# Altium schematic sheet SPI_Digital_Outputs.SchDoc
size A4; SheetNumber: 5; SheetTotal: 6
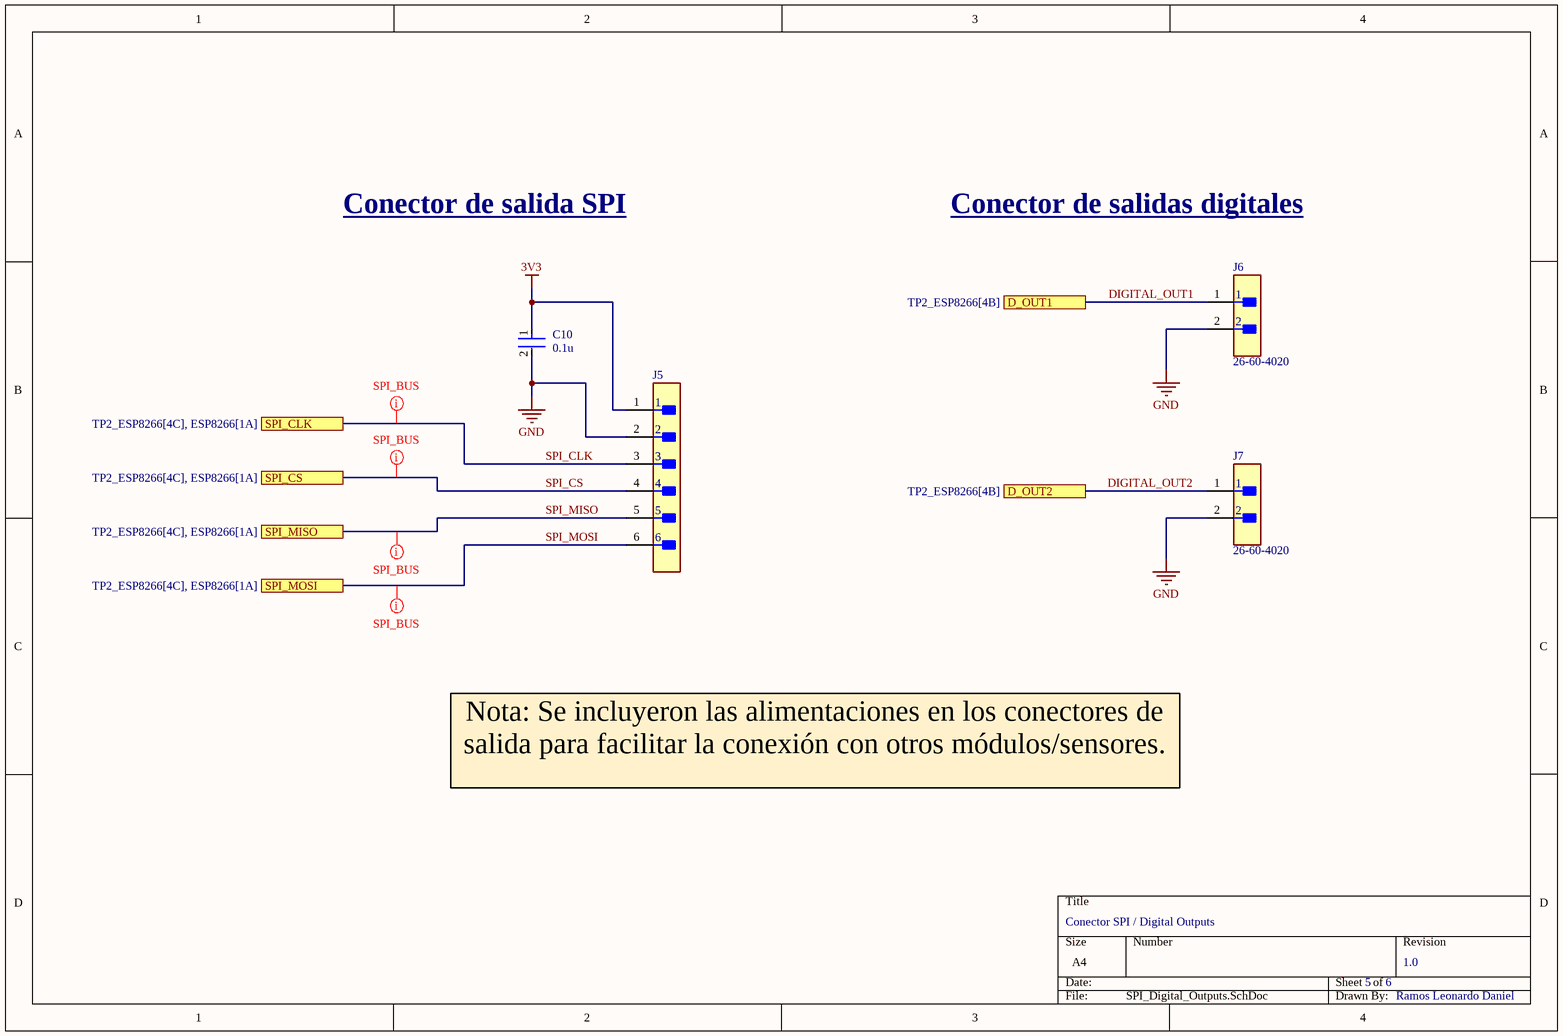
[diagram p0: SPI_Digital_Outputs.SchDoc]

## Parts
C10  value 0.1u  [FP-CC0805-0_85-MFG]  (hidden comment: CC0805KRX7R8BB104)
J5  22-27-2061  [FP-22-27-2061-MFG]  (value not drawn)
J6  26-60-4020  [FP-26-60-4020-MFG]
J7  26-60-4020  [FP-26-60-4020-MFG]

## Ports
D_OUT1 (see TP2_ESP8266[4B]), D_OUT2 (see TP2_ESP8266[4B]), SPI_CLK (see TP2_ESP8266[4C], ESP8266[1A]), SPI_CS (see TP2_ESP8266[4C], ESP8266[1A]), SPI_MISO (see TP2_ESP8266[4C], ESP8266[1A]), SPI_MOSI (see TP2_ESP8266[4C], ESP8266[1A])

## Nets
3V3: C10.1 J5.1
GND: C10.2 J5.2 J6.2 J7.2
DIGITAL_OUT1: J6.1 ; port D_OUT1
DIGITAL_OUT2: J7.1 ; port D_OUT2
SPI_CLK: J5.3 ; port SPI_CLK
SPI_CS: J5.4 ; port SPI_CS
SPI_MISO: J5.5 ; port SPI_MISO
SPI_MOSI: J5.6 ; port SPI_MOSI

## Layout directives
net class SPI_BUS: SPI_CLK, SPI_CS, SPI_MISO, SPI_MOSI

## Notes on the sheet
- Conector de salida SPI
- Conector de salidas digitales
- Nota: Se incluyeron las alimentaciones en los conectores de salida para facilitar la conexión con otros módulos/sensores.
- Conector SPI / Digital Outputs
- 5
- 6
- 1.0
- Ramos Leonardo Daniel

## Library data of the parts
C10 = CMP-1036-04410-2: CAP CER 0.1UF 25V X7R 0805; Manufacturer: Yageo; Tolerance: 0.1; Material: Ceramic; Capacitance: 100 nF; ComponentLink2URL: http://www.yageo.com/documents/recent/UPY-GPHC_Y5V_6.3V-to-50V_8.pdf; Category: Cap; Mouser Description: Multilayer Ceramic Capacitors MLCC - SMD/SMT 100nF 25V X7R 10%; Manufacturer Part Number: CC0805KRX7R8BB104; Device Class L1: Passive Components; Footprint Url: http://www.yageo.com/exep/pages/download/literatures/UPY-C_GEN_24.pdf; Height: 0.95mm; Digikey Description: CAP CER 0.1UF 25V X7R 0805; Lead Free: Yes; Temperature Range High: +85°C; Temperature: -30°C to +85°C; Ipc Land Pattern Name: CAPC200125X85; Automotive: No; Octopart: https://octopart.com/cc0805krx7r8bb104-yageo-39467766; Device Class L2: Capacitors; Temperature Characteristic: X7R; Voltage Rating: 25 V; ComponentLink2Description: Datasheet; Temperature Range Low: -30°C; Device Class L3: Ceramic Capacitors; RoHS: TRUE; Package: CC0805-0.85
J5 = CMP-04776-000309-1: CONN HEADER VERT 6POS 2.54MM; Number of Contacts: 6; Current Rating: 4A; Voltage Rating (AC): 250V; Contact Resistance: 10mR; Hole Diameter: 1.02mm; Connector Type: Male Pin; Gender: Male; Mount: Through Hole; REACH SVHC: No SVHC; Number of Rows: 1; Contact Plating: Tin; Series: KK; Depth: 5.8mm; Flammability Rating: UL94 V-0; Contact Type: Male Pin; Lead Pitch: 2.54mm; Min Operating Temperature: 0°C; Pitch: 2.54mm; Radiation Hardening: No; Color: Natural; Length: 15.24mm; Termination: Solder; Orientation: Straight; Contact Material: Brass; Max Voltage Rating (AC): 250V; Housing Material: Nylon; Max Operating Temperature: 75°C; Working Voltage: 250V; Max Current Rating: 4A; Fastening Type: Friction; Voltage Rating: 250V; Housing Color: White; Packaging: Bulk; Material: Nylon; Contact Mating Length: 0.295inch; Package Quantity: 10000; Number of Positions: 6
J6 J7 = CMP-04776-000303-1: CONN HEADER VERT 2POS 3.96MM; Number of Contacts: 2; Contact Resistance: 6mR; Current Rating: 7A; Gender: Male; Voltage Rating: 250V; Number of Lines: 1; Approvals: UL; Glow Wire Compliant: Non-compliant; Depth: 10.01mm; Color: Natural; Mount: Through Hole; Flammability Rating: UL94 V-0; Max Operating Temperature: 75°C; Termination: Solder; Lead Free: Lead Free; Length: 7.77mm; Height: 14.73mm; Min Operating Temperature: 0°C; Contact Gender: Male; Housing Material: Polyester; Number of Rows: 1; Material: Polyester; Fastening Type: Friction; Contact Material: Brass; Radiation Hardening: No; Pitch: 3.96mm; Number of Circuits: 2; Contact Plating: Tin; Packaging: Bulk; Housing Color: Natural; Contact Mating Length: 0.45inch; Contact Type: Male Pin; Number of Positions: 2; Orientation: Straight; Package Quantity: 1400; Series: KK® 41791; Max Voltage Rating (AC): 250V; RoHS Compliant: Yes; Max Current Rating: 7A; Number of Poles: 2